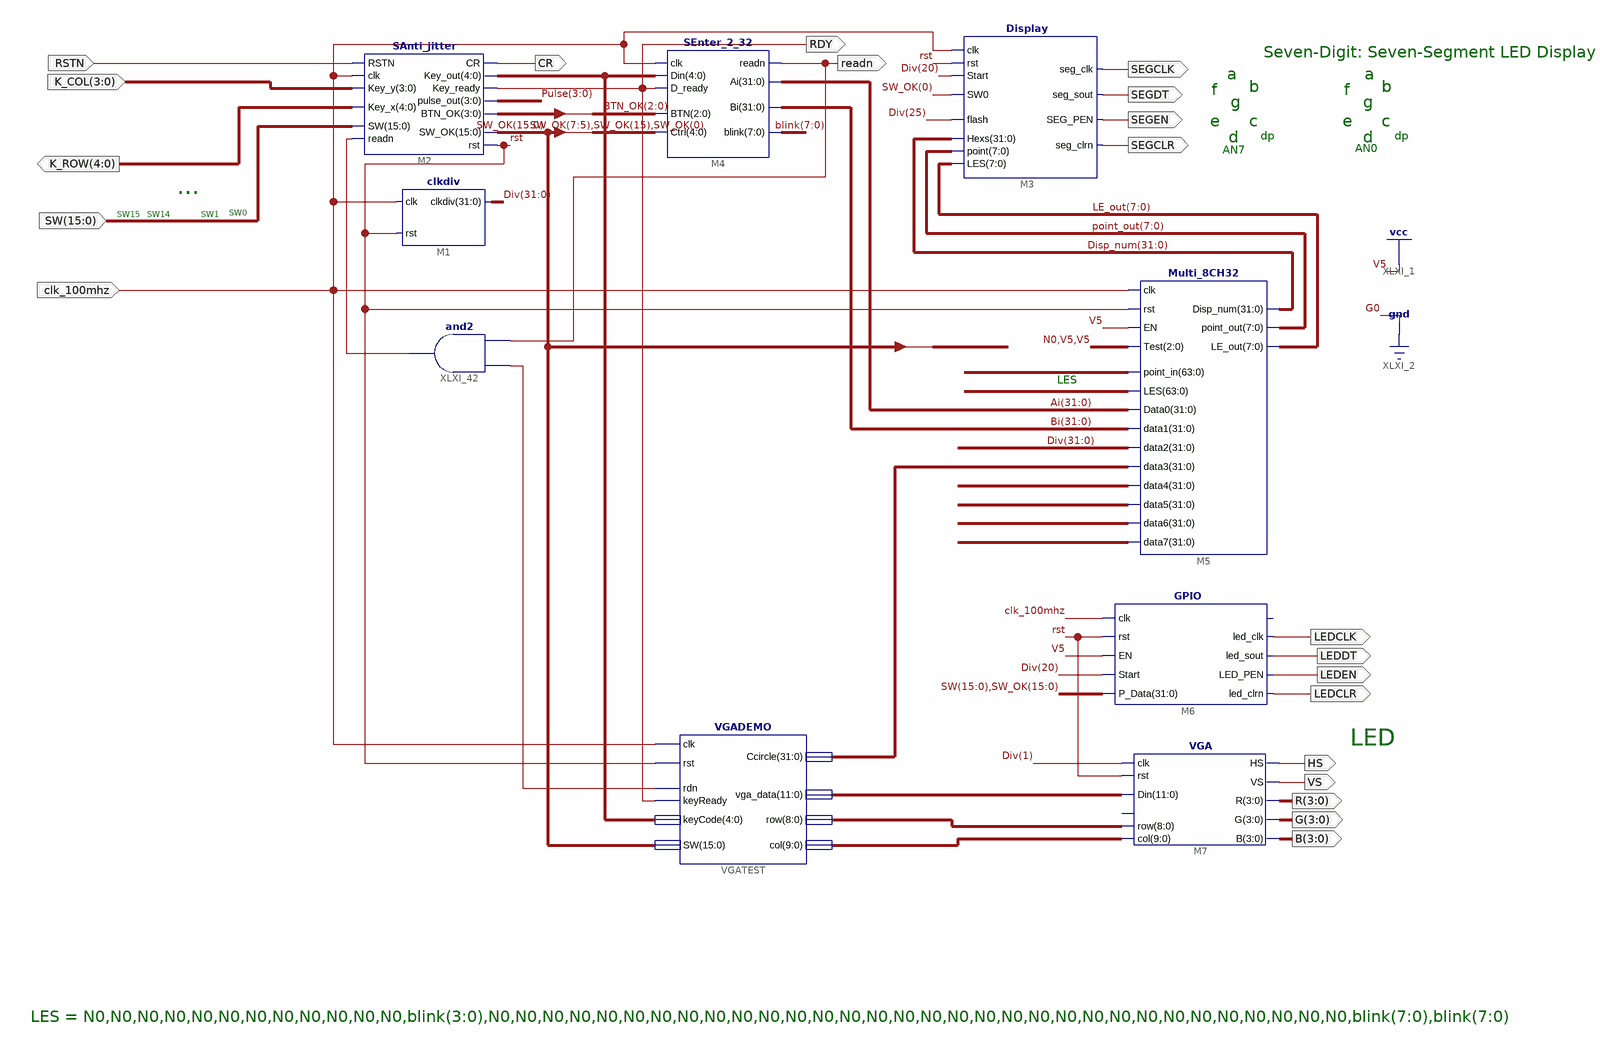
[diagram p0: schematic sheet 1]
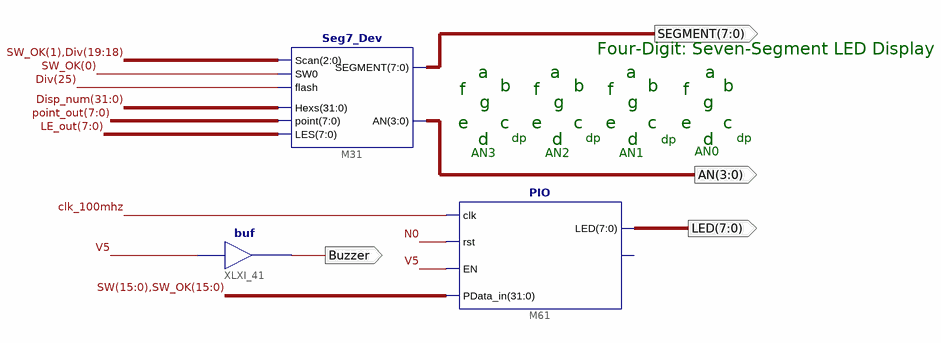
[diagram p1: schematic sheet 2]
// Xilinx ISE schematic Exp_FrameVGA.sch (kintex7) as structural Verilog: 12 symbols, 25 ports
module Exp_FrameVGA (
  input  clk_100mhz,
  input  [15:0] SW,
  input  [3:0] K_COL,
  input  RSTN,
  output SEGCLK,
  output SEGDT,
  output SEGEN,
  output SEGCLR,
  output readn,
  output RDY,
  output [4:0] K_ROW,
  output CR,
  output [7:0] SEGMENT,
  output [3:0] AN,
  output LEDCLR,
  output LEDEN,
  output LEDCLK,
  output LEDDT,
  output Buzzer,
  output [7:0] LED,
  output HS,
  output VS,
  output [3:0] R,
  output [3:0] G,
  output [3:0] B
);

  wire N0, rst, XLXN_543, XLXN_544;
  wire [3:0] BTN_OK, Pulse;
  wire [4:0] XLXN_444;
  wire [7:0] blink, LE_out, point_out;
  wire [8:0] XLXN_471;
  wire [9:0] XLXN_470;
  wire [11:0] XLXN_472;
  wire [15:0] SW_OK;
  wire [31:0] Ai, Bi, CNT, Disp_num, Div, XLXN_240, XLXN_280, XLXN_449, XLXN_469;

  SAnti_jitter M2 (
    .SW(SW), .readn(XLXN_543), .Key_y(K_COL), .Key_x(K_ROW), .RSTN(RSTN), .clk(clk_100mhz),
    .Key_out(XLXN_444), .Key_ready(RDY), .CR(CR), .rst(rst), .SW_OK(SW_OK), .pulse_out(Pulse), .BTN_OK(BTN_OK));
  SEnter_2_32 M4 (
    .readn(readn), .Ai(Ai), .Bi(Bi), .blink(blink), .Din(XLXN_444), .D_ready(RDY), .clk(clk_100mhz),
    .Ctrl({SW_OK[7:5], SW_OK[15], SW_OK[0]}), .BTN(BTN_OK[2:0]));
  clkdiv M1 (.rst(rst), .clkdiv(Div), .clk(clk_100mhz));
  Display M3 (
    .LES(LE_out), .SEG_PEN(SEGEN), .seg_sout(SEGDT), .seg_clrn(SEGCLR), .point(point_out), .Hexs(Disp_num),
    .SW0(SW_OK[0]), .flash(Div[25]), .seg_clk(SEGCLK), .clk(clk_100mhz), .rst(rst), .Start(Div[20]));
  Seg7_Dev M31 (
    .LES(LE_out), .Scan({SW_OK[1], Div[19:18]}), .SEGMENT(SEGMENT), .AN(AN), .point(point_out),
    .flash(Div[25]), .SW0(SW_OK[0]), .Hexs(Disp_num));
  Multi_8CH32 M5 (
    .Test({N0, 2'b11}), .point_in({Div, Div}), .EN(1'b1), .clk(clk_100mhz), .rst(rst),
    .LES({{12{N0}}, blink[3:0], {32{N0}}, blink, blink}), .Data0(Ai), .data1(Bi), .data2(Div), .data3(CNT),
    .data4(XLXN_240), .data5(XLXN_280), .data6(XLXN_449), .data7(XLXN_469), .point_out(point_out),
    .LE_out(LE_out), .Disp_num(Disp_num));
  GPIO M6 (
    .clk(clk_100mhz), .P_Data({SW, SW_OK}), .rst(rst), .EN(1'b1), .Start(Div[20]), .led_clrn(LEDCLR),
    .led_clk(LEDCLK), .led_sout(LEDDT), .LED_PEN(LEDEN));  // open: GPIOf0
  PIO M61 (.clk(clk_100mhz), .rst(N0), .EN(1'b1), .PData_in({SW, SW_OK}), .LED(LED));  // open: GPIOf0
  buf XLXI_41 (Buzzer, 1'b1);
  VGA M7 (
    .clk(Div[1]), .col(XLXN_470), .row(XLXN_471), .rst(rst), .Din(XLXN_472), .R(R), .G(G), .B(B), .VS(VS),
    .HS(HS));  // open: rdn
  VGADEMO VGATEST (
    .clk(clk_100mhz), .keyCode(XLXN_444), .SW(SW_OK), .Ccircle(CNT), .col(XLXN_470), .row(XLXN_471),
    .vga_data(XLXN_472), .rst(rst), .keyReady(RDY), .rdn(XLXN_544));
  and XLXI_42 (XLXN_543, readn, XLXN_544);

  // Notes on the sheet:
  //   Seven-Digit: Seven-Segment LED Display
  //   a
  //   a
  //   b
  //   b
  //   f
  //   f
  //   g
  //   g
  //   e
  //   c
  //   e
  //   c
  //   dp
  //   dp
  //   d
  //   d
  //   AN0
  //   AN7
  //   ...
  //   SW0
  //   SW15
  //   SW14
  //   SW1
  //   LES
  //   LED
  //   LES = N0,N0,N0,N0,N0,N0,N0,N0,N0,N0,N0,N0,blink(3:0),N0,N0,N0,N0,N0,N0,N0,N0,N0,N0,N0,N0,N0,N0,N0,N0,N0,N0,N0,N0,N0,N0,N0,N0,N0,N0,N0,N0,N0,N0,N0,N0,blink(7:0),blink(7:0)
  //   Four-Digit: Seven-Segment LED Display
  //   a
  //   a
  //   a
  //   a
  //   b
  //   b
  //   b
  //   b
  //   f
  //   f
  //   f
  //   f
  //   g
  //   g
  //   g
  //   g
  //   e
  //   c
  //   e
  //   c
  //   e
  //   c
  //   e
  //   c
  //   dp
  //   dp
  //   dp
  //   d
  //   d
  //   d
  //   dp
  //   d
  //   AN0
  //   AN3
  //   AN2
  //   AN1
  //   LOC on signal clk_100mhz = t9
endmodule
